# Altium schematic sheet ESP8266.SchDoc
size A4
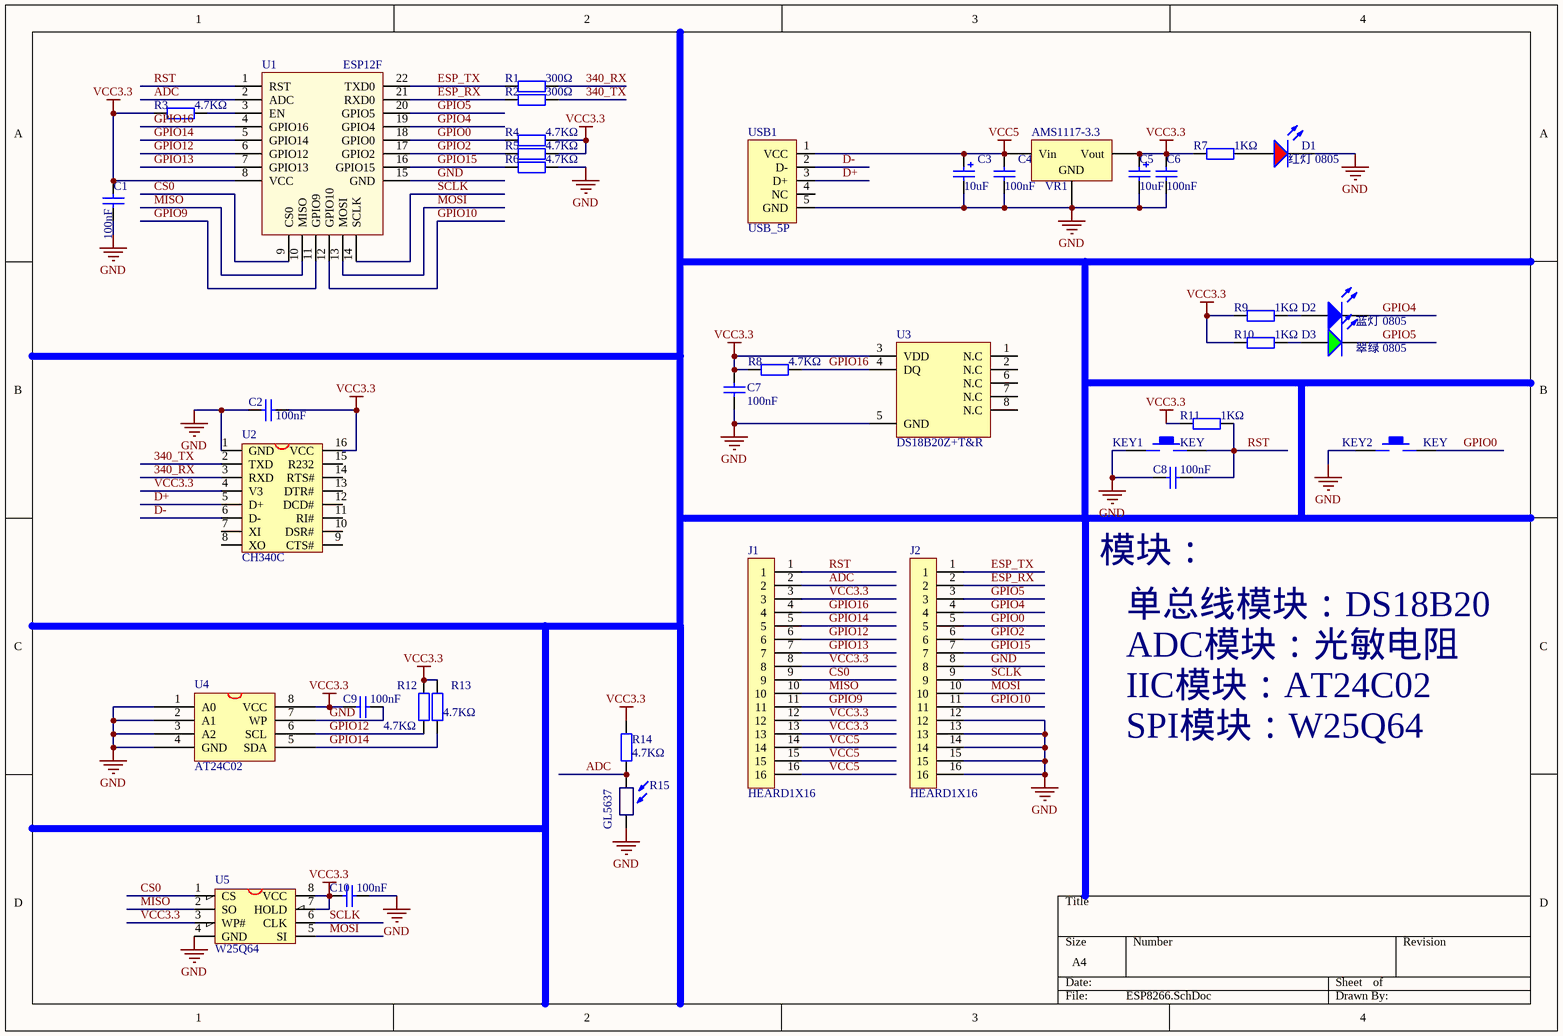
[diagram p0: ESP8266.SchDoc]

## Parts
C1  100nF  [LC-0805_C]
C2  100nF  [LC-0805_C]
C3  10uF  [LC-CASE-A_3216]
C4  100nF  [LC-0805_C]
C5  10uF  [LC-CASE-A_3216]
C6  100nF  [LC-0805_C]
C7  100nF  [LC-0805_C]
C8  100nF  [LC-0805_C]
C9  100nF  [LC-0805_C]
C10  100nF  [LC-0805_C]
D1  红灯 0805  [LC-0805_LED_S1]
D2  蓝灯 0805  [LC-0805_LED_S1]
D3  翠绿 0805  [LC-0805_LED_S1]
J1  HEARD1X16  [HDR1X16]
J2  HEARD1X16  [HDR1X16]
KEY1  KEY  [KEY_直插_6*6]
KEY2  KEY  [KEY_直插_6*6]
R1  300Ω  [LC-0805_R]
R2  300Ω  [LC-0805_R]
R3  4.7KΩ  [LC-0805_R]
R4  4.7KΩ  [LC-0805_R]
R5  4.7KΩ  [LC-0805_R]
R6  4.7KΩ  [LC-0805_R]
R7  1KΩ  [LC-0805_R]
R8  4.7KΩ  [LC-0805_R]
R9  1KΩ  [LC-0805_R]
R10  1KΩ  [LC-0805_R]
R11  1KΩ  [LC-0805_R]
R12  4.7KΩ  [LC-0805_R]
R13  4.7KΩ  [LC-0805_R]
R14  4.7KΩ  [LC-0805_R]
R15  GL5637  [Through Hole]
U1  ESP12F  [ESP6266]
U2  CH340C  [SOIC-16_150MIL]
U3  DS18B20Z+T&R  [SOIC-8_150mil]
U4  AT24C02  [SOIC-8_150mil]
U5  W25Q64  [SOIC-8_208MIL]
USB1  USB_5P  [USB_5P]
VR1  AMS1117-3.3  [LC-SOT-223]

## Nets
GND: C1.1 C2.1 C3.2 C4.1 C5.2 C6.1 C7.1 C8.1 C9.2 C10.2 D1.K J2.8 J2.12 J2.13 J2.14 J2.15 J2.16 KEY1.1 KEY2.1 R6.2 R15.2 U1.15(GND) U2.1(GND) U3.5(GND) U4.1(A0) U4.2(A1) U4.3(A2) U4.4(GND) U4.7(WP) U5.4(GND) USB1.5(GND) VR1.1(GND)
VCC3.3: C1.2 C2.2 C5.1 C6.2 C7.2 C9.1 C10.1 J1.3 J1.8 J1.12 J1.13 R3.1 R4.2 R5.2 R7.1 R8.1 R9.1 R10.1 R11.1 R12.2 R13.2 R14.2 U1.8(VCC) U2.4(V3) U2.16(VCC) U3.3(VDD) U4.8(VCC) U5.3(WP#) U5.7(HOLD) U5.8(VCC) VR1.2(Vout)
VCC5: C3.1 C4.2 J1.14 J1.15 J1.16 USB1.1(VCC) VR1.3(Vin)
340_RX: R1.2 U2.3(RXD)
340_TX: R2.2 U2.2(TXD)
ADC: J1.2 R14.1 R15.1 U1.2(ADC)
CS0: J1.9 U1.9(CS0) U5.1(CS)
D+: U2.5(D+) USB1.3(D+)
D-: U2.6(D-) USB1.2(D-)
ESP_RX: J2.2 R2.1 U1.21(RXD0)
ESP_TX: J2.1 R1.1 U1.22(TXD0)
GPIO0: J2.5 KEY2.2 R4.1 U1.18(GPIO0)
GPIO2: J2.6 R5.1 U1.17(GPIO2)
GPIO4: D2.K J2.4 U1.19(GPIO4)
GPIO5: D3.K J2.3 U1.20(GPIO5)
GPIO9: J1.11 U1.11(GPIO9)
GPIO10: J2.11 U1.12(GPIO10)
GPIO12: J1.6 R12.1 U1.6(GPIO12) U4.6(SCL)
GPIO13: J1.7 U1.7(GPIO13)
GPIO14: J1.5 R13.1 U1.5(GPIO14) U4.5(SDA)
GPIO15: J2.7 R6.1 U1.16(GPIO15)
GPIO16: J1.4 R8.2 U1.4(GPIO16) U3.4(DQ)
MISO: J1.10 U1.10(MISO) U5.2(SO)
MOSI: J2.10 U1.13(MOSI) U5.5(SI)
RST: C8.2 J1.1 KEY1.2 R11.2 U1.1(RST)
SCLK: J2.9 U1.14(SCLK) U5.6(CLK)
NetD1_A: D1.A R7.2
NetD2_A: D2.A R9.2
NetD3_A: D3.A R10.2
NetR3_2: R3.2 U1.3(EN)

Not connected (* = marked no-connect by the designer): U2 7(XI) 8(XO) 9(CTS#) 10(DSR#) 11(RI#) 12(DCD#) 13(DTR#) 14(RTS#) 15(R232); U3 1(N.C) 2(N.C) 6(N.C) 7(N.C) 8(N.C); USB1 4(NC)

## Notes on the sheet
- 模块：
- 单总线模块：DS18B20
- ADC模块：光敏电阻
- IIC模块：AT24C02
- SPI模块：W25Q64

## Library data of the parts
C1 C2 C4 C6-C10 = 0805 100nF(104) 10% 50V: 贴片电容; ComponentLink1Description: 供应商链接; ComponentLink1URL: http://www.szlcsc.com/product/details_50686.html; Package: 0805; Supplier: LC; SuppliersPartNumber: C49678
C3 C5 = 3216 10uF (106) 10% 16V: 钽电容; ComponentLink1Description: 供应商链接; ComponentLink1URL: http://www.szlcsc.com/product/details_7643.html; Package: 3216; Supplier: LC; SuppliersPartNumber: C7171
D1 = 0805 红灯: 发光二极管; ComponentLink1Description: 供应商链接; ComponentLink1URL: http://www.szlcsc.com/product/details_2668.html; Package: 0805; Supplier: LC; SuppliersPartNumber: C2295
D2 = 0805 蓝灯: 发光二极管; ComponentLink1Description: 供应商链接; ComponentLink1URL: http://www.szlcsc.com/product/details_2666.html; Package: 0805; Supplier: LC; SuppliersPartNumber: C2293
D3 = 0805 翠绿: 发光二极管; ComponentLink1Description: 供应商链接; ComponentLink1URL: http://www.szlcsc.com/product/details_2670.html; Package: 0805; Supplier: LC; SuppliersPartNumber: C2297
R1-R6 R8 R12-R14 = 0805 4.7KΩ (4701) 1%: 贴片电阻; ComponentLink1Description: 供应商链接; ComponentLink1URL: http://www.szlcsc.com/product/details_18361.html; Package: 0805; Supplier: LC; SuppliersPartNumber: C17673
R7 R9-R11 = 0805 1KΩ (1001) 1%: 贴片电阻; ComponentLink1Description: 供应商链接; ComponentLink1URL: http://www.szlcsc.com/product/details_18201.html; Package: 0805; Supplier: LC; SuppliersPartNumber: C17513
U1 = ESP8266
U2 = CH340
VR1 = SOT-223 AMS1117-3.3: 低压差线性稳压(LDO); ComponentLink1Description: 供应商链接; ComponentLink1URL: http://www.szlcsc.com/product/details_6652.html; Package: SOT-223; Supplier: LC; SuppliersPartNumber: C6186